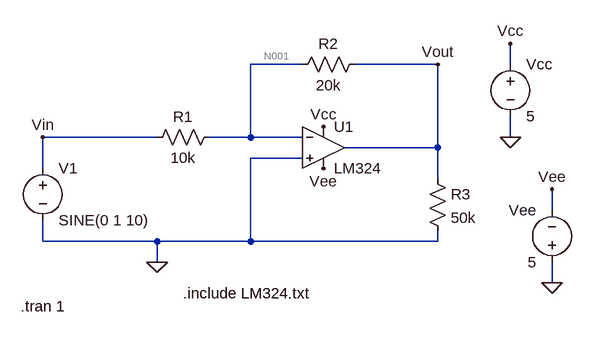
[diagram p0: schematic LM324_Example.asc]
LM324_Example.asc, the LTspice schematic file:
Version 4
SHEET 1 880 680
WIRE 160 16 80 16
WIRE 368 16 240 16
WIRE 480 16 480 -16
WIRE -64 128 -240 128
WIRE 80 128 80 16
WIRE 80 128 16 128
WIRE 160 128 80 128
WIRE 480 128 480 96
WIRE 368 144 368 16
WIRE 368 144 224 144
WIRE 160 160 80 160
WIRE -240 176 -240 128
WIRE 368 192 368 144
WIRE 544 240 544 208
WIRE -240 288 -240 256
WIRE -64 288 -240 288
WIRE 80 288 80 160
WIRE 80 288 -64 288
WIRE 368 288 368 272
WIRE 368 288 80 288
WIRE -64 320 -64 288
WIRE 544 352 544 320
FLAG -64 320 0
FLAG 480 -16 Vcc
FLAG 480 128 0
FLAG 544 352 0
FLAG 544 208 Vee
FLAG 192 176 Vee
FLAG 192 112 Vcc
FLAG -240 128 Vin
FLAG 368 16 Vout
SYMBOL voltage -240 160 R0
WINDOW 123 0 0 Left 0
WINDOW 39 0 0 Left 0
SYMATTR InstName V1
SYMATTR Value SINE(0 1 10)
SYMBOL voltage 480 0 R0
WINDOW 123 0 0 Left 0
WINDOW 39 0 0 Left 0
SYMATTR InstName Vcc
SYMATTR Value 5
SYMBOL voltage 544 336 R180
WINDOW 0 24 96 Left 2
WINDOW 3 24 16 Left 2
WINDOW 123 0 0 Left 0
WINDOW 39 0 0 Left 0
SYMATTR InstName Vee
SYMATTR Value 5
SYMBOL OpAmps\\opamp2 192 80 R0
SYMATTR InstName U1
SYMATTR Value LM324
SYMBOL res 32 112 R90
WINDOW 0 0 56 VBottom 2
WINDOW 3 32 56 VTop 2
SYMATTR InstName R1
SYMATTR Value 10k
SYMBOL res 256 0 R90
WINDOW 0 0 56 VBottom 2
WINDOW 3 32 56 VTop 2
SYMATTR InstName R2
SYMATTR Value 20k
SYMBOL res 352 176 R0
SYMATTR InstName R3
SYMATTR Value 50k
TEXT -24 368 Left 2 !.include LM324.txt
TEXT -274 388 Left 2 !.tran 1

The netlist it stands for:
* LM324_Example.asc
V1 Vin 0 SINE(0 1 10)
Vcc Vcc 0 5
Vee 0 Vee 5
XU1 0 N001 Vcc Vee Vout LM324  ; pins In+ In- V+ V- OUT
R1 N001 Vin 10k
R2 Vout N001 20k
R3 Vout 0 50k
.include LM324.txt
.tran 1
.backanno
.end

* Results of the author's LTspice run, read from the files saved beside the schematic
* Operating Point, zero values left out:
*   V(vcc) = 5 V
*   V(vee) = -5 V
*   V(vout) = -499.8 µV
*   V(n001) = -33.65 µV
*   I(R3) = -9.997 nA
*   I(R2) = -23.31 nA
*   I(R1) = -3.365 nA
*   I(Vee) = -339.9 µA
*   I(Vcc) = -340 µA
*   I(V1) = -3.365 nA
*   Ix(u1:1) = -19.93 nA
*   Ix(u1:2) = -19.94 nA
*   Ix(u1:3) = 340 µA
*   Ix(u1:4) = -339.9 µA
*   Ix(u1:5) = 33.31 nA
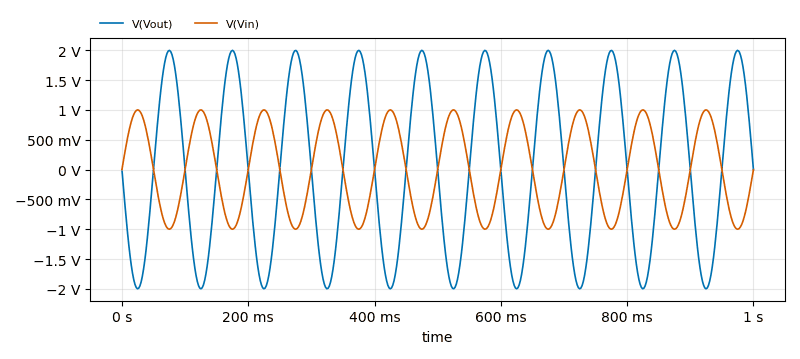
[diagram p1: Transient Analysis of LM324_Example.asc, plotted from the saved traces]
* Transient Analysis, 1 run:
*   V(Vout): min -1.999 V, max 1.998 V, average -498.1 µV, rms 1.413 V, last -439.4 µV
*   V(Vin): min -1 V, max 1 V, average -905.4 nV, rms 707.2 mV, last 0 V